# Altium schematic sheet USB_trans.SchDoc
size A4; DocumentNumber: 11; SheetNumber: 11; SheetTotal: 21; SheetName: USB Full Speed tranceiver
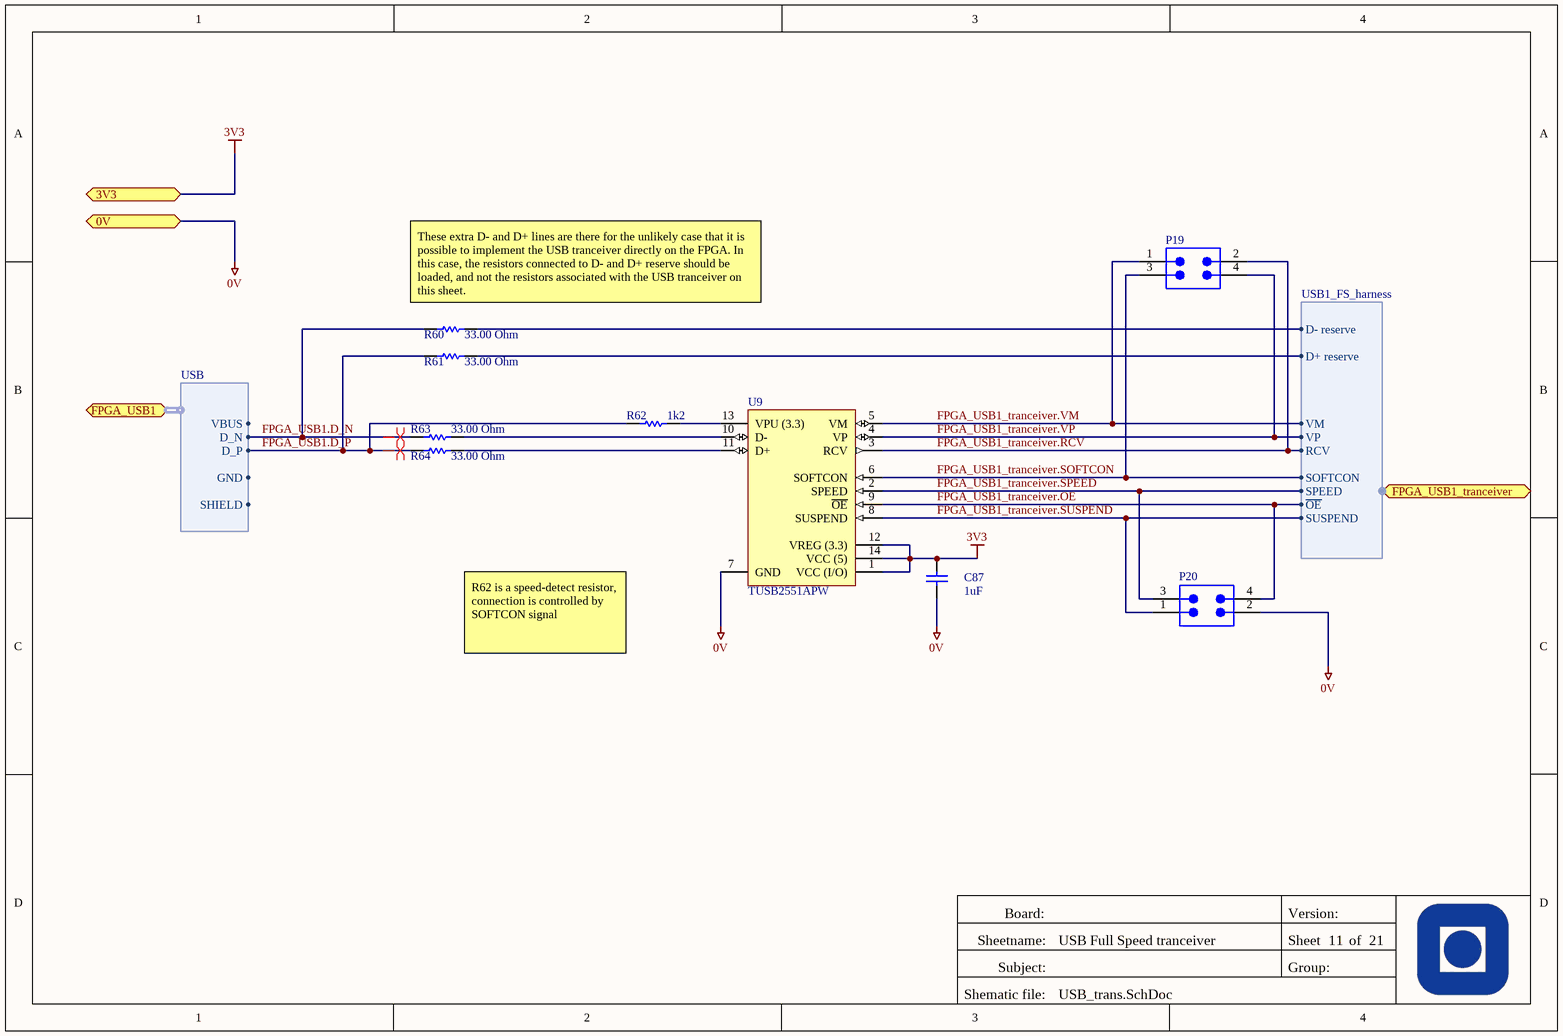
[diagram p0: USB_trans.SchDoc]

## Parts
C87  value 1uF  [CAPC0603(1608)100_N]  (hidden comment: CAP 1uF 16V 0603(1608))
P19  PH2542-4-SPGRH-6-3  [PCE-PH2542-4-SPGRH-6-3_V]  (value not drawn)
P20  PH2542-4-SPGRH-6-3  [PCE-PH2542-4-SPGRH-6-3_V]  (value not drawn)
R60  value 33.00 Ohm  [RESC0603(1608)_M]  (hidden comment: 33R 5% 0603(1608))
R61  value 33.00 Ohm  [RESC0603(1608)_M]  (hidden comment: 33R 5% 0603(1608))
R62  value 1k2  [RESC0603(1608)_M]  (hidden comment: 1K2 1% 0603(1608))
R63  value 33.00 Ohm  [RESC0603(1608)_M]  (hidden comment: 33R 5% 0603(1608))
R64  value 33.00 Ohm  [RESC0603(1608)_M]  (hidden comment: 33R 5% 0603(1608))
U9  TUSB2551APW  [PW14_N]

## Ports
0V, 3V3, FPGA_USB1 (harness USB), FPGA_USB1_tranceiver (harness USB1_FS_harness)

## Harnesses
USB1_FS_harness: VM, VP, RCV, SOFTCON, SPEED, ~{OE}, SUSPEND, D- reserve, D+ reserve
USB: D_P, D_N, VBUS, GND, SHIELD

## Nets
0V: C87.1 P20.2 U9.7(GND) ; port 0V
3V3: C87.2 U9.1(VCC_(I/O)) U9.12(VREG_(3.3)) U9.14(VCC_(5)) ; port 3V3
FPGA_USB1.D_N: R60.1 R63.1 ; port FPGA_USB1.D_N
FPGA_USB1.D_P: R61.1 R62.1 R64.1 ; port FPGA_USB1.D_P
FPGA_USB1_tranceiver.~{OE}: P20.4 U9.9(~{OE}) ; port FPGA_USB1_tranceiver.~{OE}
FPGA_USB1_tranceiver.RCV: P19.2 U9.3(RCV) ; port FPGA_USB1_tranceiver.RCV
FPGA_USB1_tranceiver.SOFTCON: P19.3 U9.6(SOFTCON) ; port FPGA_USB1_tranceiver.SOFTCON
FPGA_USB1_tranceiver.SPEED: P20.3 U9.2(SPEED) ; port FPGA_USB1_tranceiver.SPEED
FPGA_USB1_tranceiver.SUSPEND: P20.1 U9.8(SUSPEND) ; port FPGA_USB1_tranceiver.SUSPEND
FPGA_USB1_tranceiver.VM: P19.1 U9.5(VM) ; port FPGA_USB1_tranceiver.VM
FPGA_USB1_tranceiver.VP: P19.4 U9.4(VP) ; port FPGA_USB1_tranceiver.VP
NetR60_2: R60.2 ; port FPGA_USB1_tranceiver.D- reserve
NetR61_2: R61.2 ; port FPGA_USB1_tranceiver.D+ reserve
NetR62_2: R62.2 U9.13(VPU_(3.3))
NetR63_2: R63.2 U9.10(D-)
NetR64_2: R64.2 U9.11(D+)

## Layout directives
differential pair: FPGA_USB1.D_N, FPGA_USB1.D_P

## Notes on the sheet
- (near R60) These extra D- and D+ lines are there for the unlikely case that it is possible to implement the USB tranceiver directly on the FPGA. In this case, the resistors connected to D- and D+ reserve should be loaded, and not the resistors associated with the USB tranceiver on this sheet.
- R62 is a speed-detect resistor, connection is controlled by SOFTCON signal
- Board:
- Version:
- Sheetname:
- Subject:
- Group:
- Sheet
- of
- Shematic file:

## Library data of the parts
C87 = CMP-1035-02736-1: CAP 1uF 16V ±5% 0603 (1608 Metric) Thickness 1mm SMD; Case-Metric: 1608; Case-EIA: 0603; Tolerance: Â±5%; Technology: SMT; Max Thickness: 1 mm; Rated Voltage: 16 V
P19 P20 = CMP-0423-00002-1: Male Header, Pitch 2.54mm, 2x2 Position, Mated Height 6mm, Tail Length 3mm; Manufacturer: Pinchao Electronic; ComponentLink1Description: Manufacturer URL; Mounting Technology: Through Hole; PartNumber: PH2542-4-SPGRH-6-3; PackageDescription: Male Header, Pitch 2.54mm, 2x10 Position, Mated Height 6mm, Tail Length 3mm; PackageReference: PH2542-4-SPGRH-6-3; ComponentLink1URL: http://www.suzhoupinchao.com/; Terminal Pitch: 2.54 mm
R60 R61 R63 R64 = CMP-1012-00038-1: 33R 0.1W 5% 0603 (1608 Metric)  SMD; Case-EIA: 0603; Case-Metric: 1608; Tolerance: 5 %; Technology: SMT; Power: 0.1 W
R62 = CMP-1012-00518-1: 1K2 0.1W 1% 0603 (1608 Metric)  SMD; Case-EIA: 0603; Case-Metric: 1608; Power: 0.1 W; Technology: SMT; Tolerance: 1 %
U9 = CMP-0309-00089-1: Advanced USB Transceiver, Full Speed, Single, +/-15 KV, -40 to 85 degC, 14-Pin TSSOP (PW); Manufacturer: Texas Instruments; ComponentLink1Description: Datasheet; PackageDescription: 14-Pin Thin Small Outline Package 0.65 mm Pitch; PackageReference: PW14; USB Speed: Full; ComponentLink2Description: Package Specification; PackageVersion: revG, Feb-2011; SubFamily: USB Transceiver; DatasheetVersion: SCES790; PartNumber: TUSB2551APW; Code_JEDEC: MO-153; ESD HBM(kV): +/-15; ComponentLink1URL: http://www.ti.com/general/docs/lit/getliterature.tsp?genericPartNumber=TUSB2551A&fileType=pdf; ComponentLink2URL: http://www.ti.com/lit/ml/mpds360/mpds360.pdf; Mounting Technology: Surface Mount